# Altium schematic sheet Sensor_interfacing.SchDoc
size A4; SheetNumber: 6; SheetTotal: 6
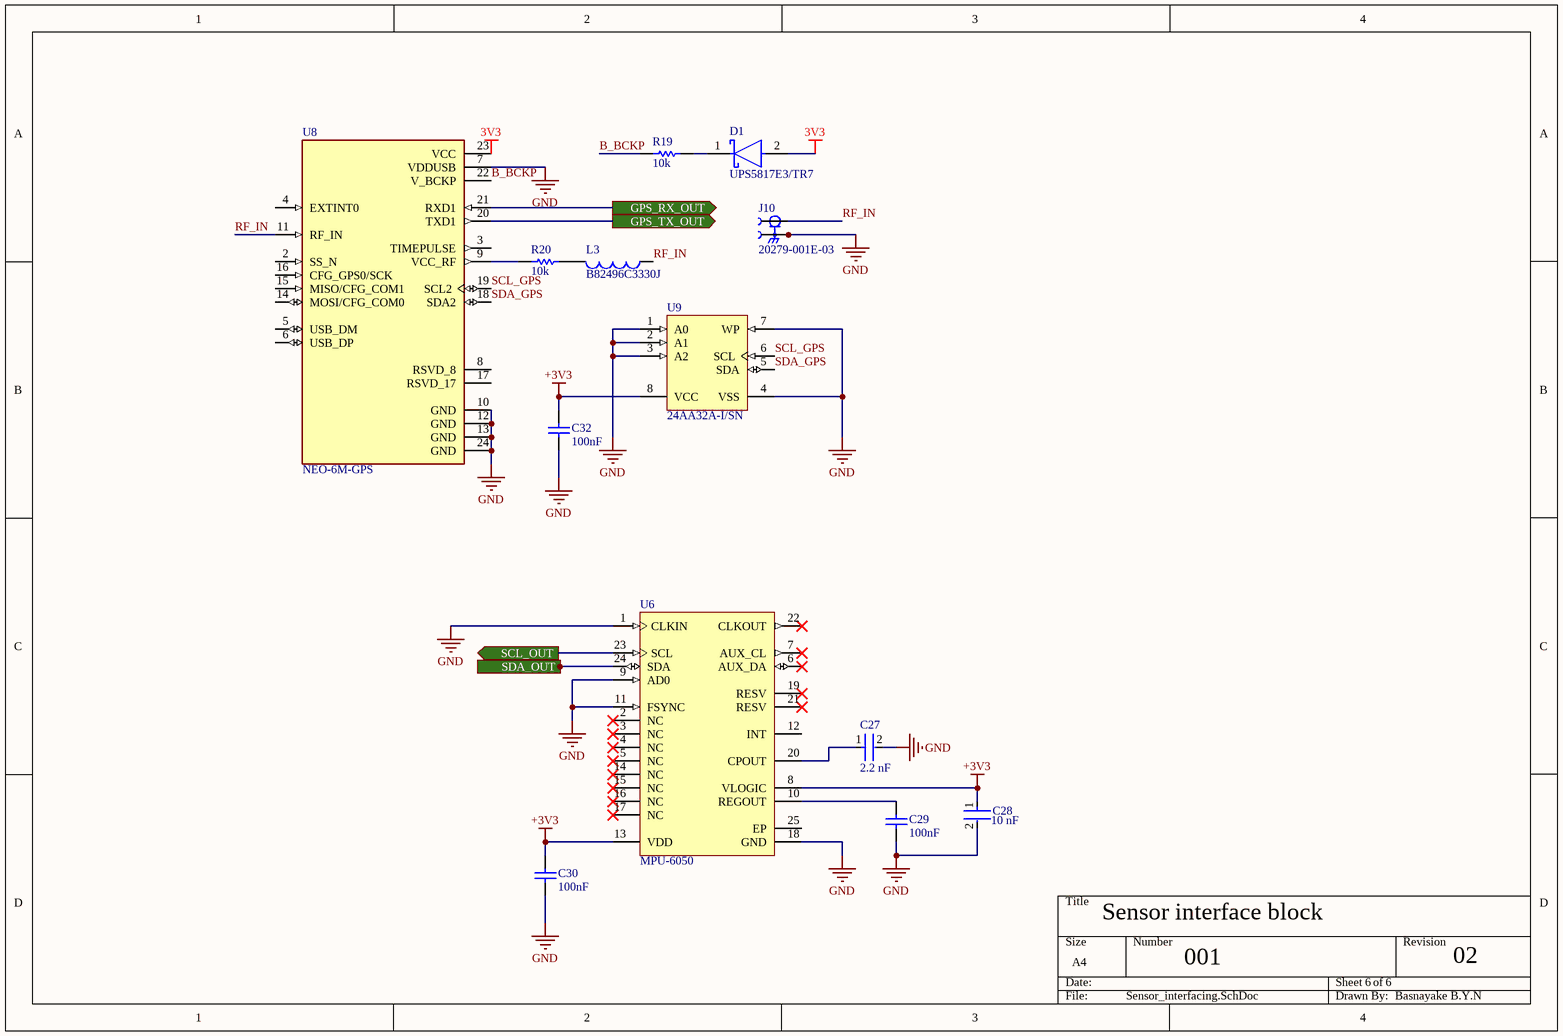
[diagram p0: Sensor_interfacing.SchDoc]

## Parts
C27  Capacitance: 2.2 nF  [FP-CC0402-MFG]  (hidden comment: CC0402KRX7R9BB222)
C28  Capacitance: 10 nF  [FP-CC0402-MFG]  (hidden comment: CC0402KRX7R9BB103)
C29  Capacitance: 100nF  [CAPC1050X55X23ML05T13]  (hidden comment: CL05B104KO5NNNC)
C30  Capacitance: 100nF  [CAPC1050X55X23ML05T13]  (hidden comment: CL05B104KO5NNNC)
C32  Capacitance: 100nF  [CAPC1050X55X23ML05T13]  (hidden comment: CL05B104KO5NNNC)
D1  UPS5817E3/TR7  [FP-DO-216AA-MFG]
J10  20279-001E-03  [IPEX_20279-001E-03]
L3  B82496C3330J  [INDC1608X90X30LL10T20]
R19  Parameter 1: 10k  [RESC2013X60X35NL10T20]  (hidden comment: RC0805FR-0710KL)
R20  Parameter 1: 10k  [RESC2013X60X35NL10T20]  (hidden comment: RC0805FR-0710KL)
U6  MPU-6050  [IS-QFN-24_V]
U8  NEO-6M-GPS  [XCVR_NEO-6M-GPS]
U9  24AA32A-I/SN  [SOIC-SN8_L]

## Ports
GPS_RX_OUT (out, see Top_domain[2B]), GPS_TX_OUT (out, see Top_domain[2B]), SCL_OUT (out, see Top_domain[2B]), SDA_OUT (out, see Top_domain[2B])

## Nets
3V3: D1.2(A) U8.23(VCC)
+3V3: C28.1 C30.2 C32.2 U6.8(VLOGIC) U6.13(VDD) U9.8(VCC)
GND: C27.2 C28.2 C29.1 C30.1 C32.1 J10.2(GROUND) J10.3(GROUND) U6.1(CLKIN) U6.9(AD0) U6.11(FSYNC) U6.18(GND) U8.7(VDDUSB) U8.10(GND) U8.12(GND) U8.13(GND) U8.24(GND) U9.1(A0) U9.2(A1) U9.3(A2) U9.4(VSS) U9.7(WP)
B_BCKP: R19.1 U8.22(V_BCKP)
GPS_RX_OUT: U8.21(RXD1) ; port GPS_RX_OUT
GPS_TX_OUT: U8.20(TXD1) ; port GPS_TX_OUT
RF_IN: J10.1(SIGNAL) L3.1 U8.11(RF_IN)
SCL_GPS: U8.19(SCL2) U9.6(SCL)
SCL_OUT: U6.23(SCL) ; port SCL_OUT
SDA_GPS: U8.18(SDA2) U9.5(SDA)
SDA_OUT: U6.24(SDA) ; port SDA_OUT
NetC27_1: C27.1 U6.20(CPOUT)
NetC29_2: C29.2 U6.10(REGOUT)
NetD1_1: D1.1(C) R19.2
NetL3_2: L3.2 R20.2
NetR20_1: R20.1 U8.9(VCC_RF)

Not connected (* = marked no-connect by the designer): U6 2(NC)* 3(NC)* 4(NC)* 5(NC)* 6(AUX_DA)* 7(AUX_CL)* 12(INT) 14(NC)* 15(NC)* 16(NC)* 17(NC)* 19(RESV)* 21(RESV)* 22(CLKOUT)* 25(EP); U8 2(SS_N) 3(TIMEPULSE) 4(EXTINT0) 5(USB_DM) 6(USB_DP) 8(RSVD_8) 14(MOSI/CFG_COM0) 15(MISO/CFG_COM1) 16(CFG_GPS0/SCK) 17(RSVD_17)

## Notes on the sheet
- Sensor interface block
- 001
- 6
- 02
- Basnayake B.Y.N

## Library data of the parts
C27 = CMP-1034-01742-2: CAP CER 2200PF 50V X7R 0402; Manufacturer: YAGEO; Material: Ceramic; Automotive Grade: NA; Temperature Coefficient: 30ppm/°C; Tolerance: 0.1; Value: 2.2 nF; Footprint Url: http://www.yageo.com/exep/pages/download/literatures/UPY-C_GEN_24.pdf; Temperature: -55°C to +125°C; RoHS: TRUE; Mouser Description: Multilayer Ceramic Capacitors MLCC - SMD/SMT 2.2nF 50V X7R 10%; Temperature Range Low: -55°C; ComponentLink2URL: http://www.yageo.com/documents/recent/UPY-GP_NP0_16V-to-50V_16.pdf; Digikey Description: CAP CER 2200PF 50V X7R 0402; Manufacturer Part Number: CC0402KRX7R9BB222; Device Class L3: Ceramic Capacitors; Lead Free: Yes; Octopart: https://octopart.com/cc0402krx7r9bb222-yageo-39467642; Package: CC0402; ComponentLink2Description: Datasheet; Category: Cap; Device Class L1: Passive Components; Height: 0.55mm; Temperature Characteristic: X7R; Device Class L2: Capacitors; Voltage Rating: 50 V; Ipc Land Pattern Name: CAPC10050X50; Temperature Range High: +125°C; Automotive: No
C28 = CMP-2100-03592-2: CAP CER 10000PF 50V X7R 0402; Manufacturer: YAGEO; Temperature Coefficient: 30ppm/°C; Material: Ceramic; Automotive Grade: NA; Tolerance: 0.1; Value: 10 nF; Device Class L3: Ceramic Capacitors; Temperature: -55°C to +125°C; Footprint Url: http://www.yageo.com/exep/pages/download/literatures/UPY-C_GEN_24.pdf; Ipc Land Pattern Name: CAPC10050X50; Device Class L1: Passive Components; Automotive: No; Octopart: https://octopart.com/cc0402krx7r9bb103-yageo-8376513; Manufacturer Part Number: CC0402KRX7R9BB103; Lead Free: Yes; Temperature Range Low: -55°C; Height: 0.55mm; ComponentLink2URL: http://www.yageo.com/documents/recent/UPY-GP_NP0_16V-to-50V_16.pdf; Category: Cap; ComponentLink2Description: Datasheet; Temperature Range High: +125°C; Digikey Description: CAP CER 10000PF 50V X7R 0402; Voltage Rating: 50 V; Package: CC0402; Device Class L2: Capacitors; Mouser Description: 0402 10 nF 50 V ±10 % Tolerance X7R SMT Multilayer Ceramic Capacitor; RoHS: TRUE; Temperature Characteristic: X7R
C29 C30 C32 = CMP-2000-05439-1: Chip Capacitor, 100 nF, +/- 10%, 16 V, -55 to 125 degC, 0402 (1005 Metric), RoHS, Tape and Reel; Manufacturer: Samsung Electro-Mechanics; Dielectric: X7R; Rated Voltage: 16V; Case Size/Dimension: 0402; Tolerance (%): ±10%; Manufacturer URL: http://www.samsungsem.com/global/index.jsp; Datasheet URL: https://datasheet.ciiva.com/29198/458718-da-01-en-vs-kondensator-0402-29198423.pdf; Datasheet Version: Nov-10
D1 = CMP-00252-99195103-1: UPS5817E3/TR7 Rectifier Diode, Schottky, 1 Phase, 1 Element, 1A, 20V V(RRM), Silicon, DO-216AA; Capacitance: 105pF; Element Configuration: Single; Polarity: Standard; Forward Voltage: 450mV; Peak Non-Repetitive Surge Current: 50A; Peak Reverse Current: 1mA; NexarPartId: 99195103; Average Rectified Current: 1A; Min Operating Temperature: -55°C; Forward Current: 1A; Reverse Voltage (DC): 20V; Height: 1.14mm; Lead Free: Lead Free; Width: 2.03mm; Schedule B: 8541100080, 8541100080; Length: 2.03mm; Lifecycle Status: Production; Output Current: 1A; Packaging: Tape & Reel (TR); Voltage Rating (DC): 20V; RoHS: Compliant; Number of Pins: 1; Max Forward Surge Current (Ifsm): 50A; Max Repetitive Reverse Voltage (Vrrm): 20V; Mount: Surface Mount; Max Reverse Voltage (DC): 20V; Max Operating Temperature: 150°C; Radiation Hardening: No; Current Rating: 1A
J10 = 20279-001E-03: 1 POS Vertical SMD Small form factor with big performance through 6 GHz connector,MHF, RF, micro-coaxial MHF I Receptacle; MF: I-PEX; SnapEDA_Link: https://www.snapeda.com/parts/20279-001E-03/I-PEX/view-part/?ref=snap; Package: None; Value: *; MP: 20279-001E-03; Check_prices: https://www.snapeda.com/parts/20279-001E-03/I-PEX/view-part/?ref=eda
L3 = CMP-2000-05913-1: Unshielded Wirewound Inductor, 33 nH, 350 mA, -55 to 150 degC, 0603 (1608 Metric), RoHS, Tape and Reel; Manufacturer: EPCOS-(TDK); Q @ Freq: 14@100MHz; Inductance: 33nH; Material - Core: Ceramic; Frequency - Self Resonant: 3GHz; DC Resistance (DCR): 600mOhmMax; Tolerance: ±5%; Frequency - Test: 100MHz; Current Rating: 350mA; Manufacturer URL: http://www.tdk.com/; Type: Wirewound; Mounting Type: SurfaceMount; Mounting Technology: SurfaceMount; Height - Seated (Max): 0.035"(0.90mm); Datasheet URL: https://en.tdk.eu/inf/30/db/ind_2008/b82496c.pdf; Shielding: Unshielded; Operating Temperature: -; Size / Dimension: 0.063"Lx0.031"W(1.60mmx0.80mm); Series: SIMID; Current - Saturation: -; Ratings: AEC-Q200; Packaging: CutTape(CT); Package Reference: 0603; Datasheet Version: 07/2016; Category: Inductors,Coils,Chokes; Package Description: 2-Pin Surface Mount Device, Body 1.6 x 0.8 mm; Family: FixedInductors; Package / Case: 0603(1608Metric)
R19 R20 = CMP-1659-00013-4: Chip Resistor, 10 KOhm, +/- 1%, 0.125 W, -55 to 155 degC, 0805 (2012 Metric), RoHS, Tape and Reel; Manufacturer: Yageo; Voltage Rating: 150 V; Mount: Surface Mount; ComponentLink1Description: Manufacturer URL; ComponentLink2URL: http://www.yageo.com/documents/recent/PYu-RC_Group_51_RoHS_L_04.pdf; Pins: 2; Length: 2 mm; Min Operating Temperature: -55 degC; Height: 0.5 mm; Mounting Technology: Surface Mount; RoHSCompliant: true; REACH SVHC: No SVHC; ComponentLink1URL: http://www.yageo.com/; Max Operating Temperature: 155 degC; PackageReference: 0805; DatasheetVersion: Rev. 4, 02/2016; Package Quantity: 5000; Packaging: Tape and Reel; ComponentLink2Description: Datasheet; PackageDescription: 2-Pin Surface Mounted Device, Body 2 x 1.25 mm
U6 = CMP-1753-00002-2: 3-Axis Gyroscope, Accelerometer and a Digital Motion Processor(TM) (DMP), 2.375 to 3.46 V, -40 to 85 degC, 24-Pin QFN, RoHS, Tape and Reel; Manufacturer: InvenSense; Featured Product: MPU-60506-Axis,IntegratedI²CSolution; Other Names: 1428-1007-2 / MPU6050; Sensor Type: MotionTracking; Online Catalog: MPU-6000™Series; Unit PriceUSD: Digital; Datasheet Version: Rev. 3.3, 05/2012; Category: Sensors,Transducers; Datasheet URL: http://datasheet.octopart.com/MPU-6050-InvenSense-datasheet-14421344.pdf; Family: Multifunction; Standard Package: 5,000; Manufacturer URL: http://www.invensense.com/; Output Type: Digital; Dynamic Catalog: MPU-6000™Series
U8 = CMP-006-000000-1: GPS Development Tools SparkFun GNSS-RTK Dead Reckoning Breakout - ZED-F9K (Qwiic); MF: u-blox; Price: None; Source: NEO-6M-GPS.SchLib; Availability: Not in stock; MP: NEO-6M-GPS; Component Type: Standard; Check_prices: https://www.snapeda.com/parts/NEO-6M-GPS/u-blox/view-part/?ref=eda; Value: *; Design Item ID: NEO-6M-GPS; Pin Count: 23; Package: None; SnapEDA_Link: https://www.snapeda.com/parts/NEO-6M-GPS/u-blox/view-part/?ref=snap
U9 = CMP-0159-00205-1: 32Kbit, 400kHz, 1.7V, I2C Serial EEPROM, 8-Pin SOIC 150mil, Industrial Temperature; Code_JEDEC: MS-012; PackageVersion: revBB, Aug-2009; PackageReference: SOIC-SN8; PackageDescription: 8-Lead Plastic Small Outline (SN) - Narrow, 3.90mm Body [SOIC]; Code_IPC: SOIC127P600-8; DatasheetVersion: revJ, Feb-2009